# EAGLE design OneWireGateway_4x (EAGLE 7.2.0)

## Sheet 1 of 3
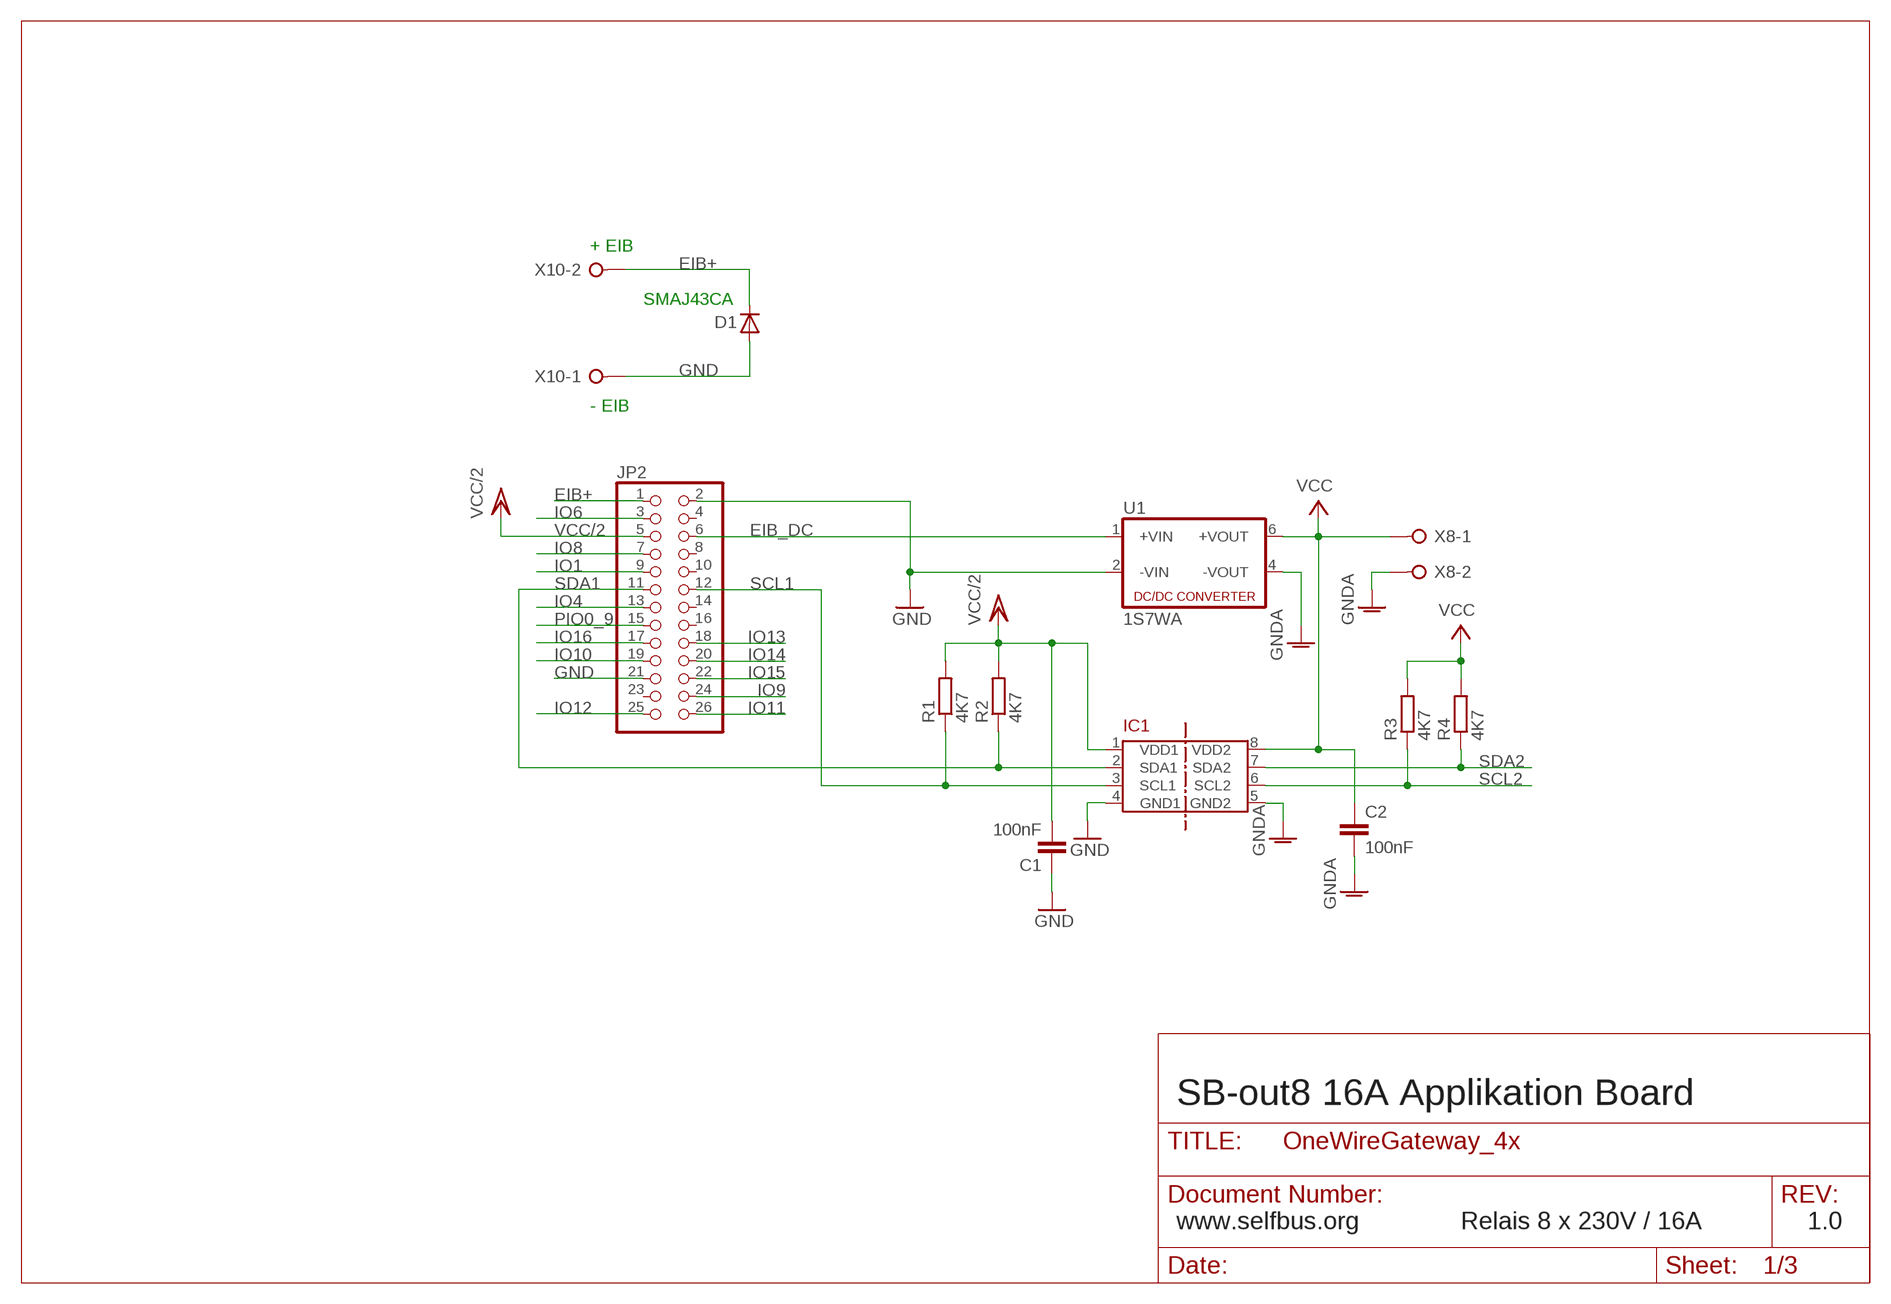
[diagram p0: schematic, sheet 1]

### Parts
C1  100nF  C-EUC0805  [C0805]
C2  100nF  C-EUC0805  [C0805]
D1  SMAJ40CA  D-SMB  [SMB]
IC1  ADUM1250  [SO08]
JP2  PINHD-2X13_2.54-SMD  [2X13SMD]
R1  4K7  R-EU_R0805  [R0805]
R2  4K7  R-EU_R0805  [R0805]
R3  4K7  R-EU_R0805  [R0805]
R4  4K7  R-EU_R0805  [R0805]
U1  1S7WA  [7PIN_SIP]
X8  W237-02P  [W237-132]
X10  W237-02P  [W237-132]

### Nets
EIB+: D1.1(C) JP2.1 X10.2
EIB_DC: JP2.6 U1.1(+VIN)
GND: C1.1 D1.2(A) IC1.4(GND1) JP2.2 JP2.21 U1.2(-VIN) X10.1
GNDA: C2.2 IC1.5(GND2) U1.4(-VOUT) X8.2 ; also sheet 2,3
IO1: JP2.9
IO4: JP2.13
IO6: JP2.3
IO8: JP2.7
IO9: JP2.24
IO10: JP2.19
IO11: JP2.26
IO12: JP2.25
IO13: JP2.18
IO14: JP2.20
IO15: JP2.22
IO16: JP2.17
PIO0_9: JP2.15
SCL1: IC1.3(SCL1) JP2.12 R1.1
SCL2: IC1.6(SCL2) R3.1 ; also sheet 2,3
SDA1: IC1.2(SDA1) JP2.11 R2.1
SDA2: IC1.7(SDA2) R4.1 ; also sheet 2,3
VCC: C2.1 IC1.8(VDD2) R3.2 R4.2 U1.6(+VOUT) X8.1 ; also sheet 2,3
VCC/2: C1.2 IC1.1(VDD1) JP2.5 R1.2 R2.2
Unconnected: JP2.4 JP2.8 JP2.10 JP2.14 JP2.16 JP2.23

### Notes on the sheet
- + EIB
- SMAJ43CA
- - EIB
- SB-out8 16A Applikation Board
- www.selfbus.org | Relais 8 x 230V / 16A | 1.0

## Sheet 2 of 3
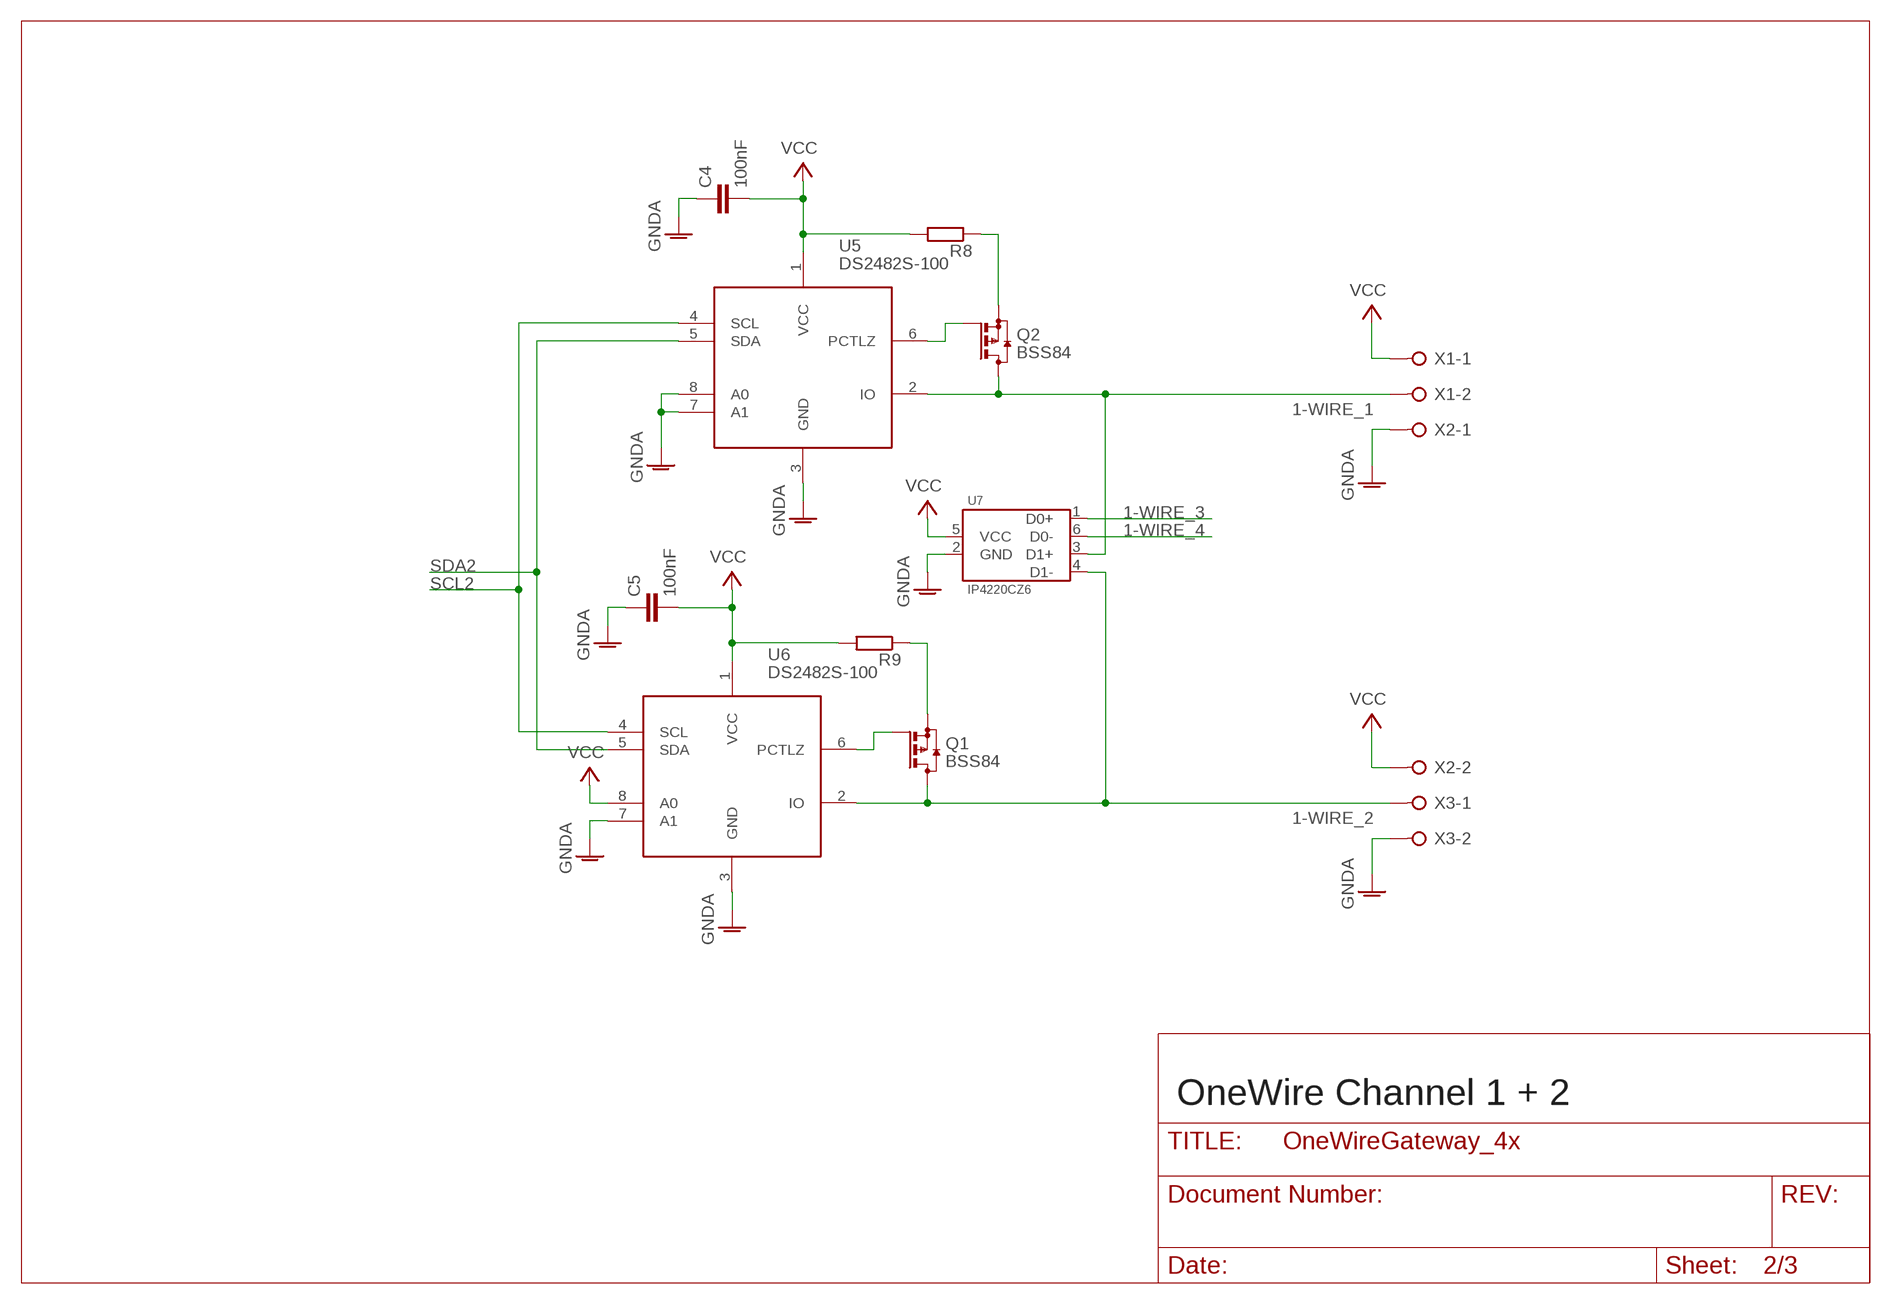
[diagram p1: schematic, sheet 2]

### Parts
C4  100nF  C-EUC0805  [C0805]
C5  100nF  C-EUC0805  [C0805]
Q1  BSS84  [SOT23]
Q2  BSS84  [SOT23]
R8  R-EU_R0805  [R0805]
R9  R-EU_R0805  [R0805]
U5  DS2482S-100  DS2482-100+1  [SO8]
U6  DS2482S-100  DS2482-100+1  [SO8]
U7  IP4220CZ6  [SOT-6]
X1  W237-02P  [W237-132]
X2  W237-02P  [W237-132]
X3  W237-02P  [W237-132]

### Nets
1-WIRE_1: Q2.3(D) U5.2(IO) U7.3(D1+) X1.2
1-WIRE_2: Q1.3(D) U6.2(IO) U7.4(D1-) X3.1
1-WIRE_3: U7.1(D0+) ; also sheet 3
1-WIRE_4: U7.6(D0-) ; also sheet 3
GNDA: C4.1 C5.1 U5.3(GND) U5.7(A1) U5.8(A0) U6.3(GND) U6.7(A1) U7.2(GND) X2.1 X3.2 ; also sheet 1,3
N$5: Q2.1(G) U5.6(PCTLZ)
N$8: Q2.2(S) R8.1
N$9: Q1.2(S) R9.1
N$13: Q1.1(G) U6.6(PCTLZ)
SCL2: U5.4(SCL) U6.4(SCL) ; also sheet 1,3
SDA2: U5.5(SDA) U6.5(SDA) ; also sheet 1,3
VCC: C4.2 C5.2 R8.2 R9.2 U5.1(VCC) U6.1(VCC) U6.8(A0) U7.5(VCC) X1.1 X2.2 ; also sheet 1,3

### Notes on the sheet
- OneWire Channel 1 + 2

## Sheet 3 of 3
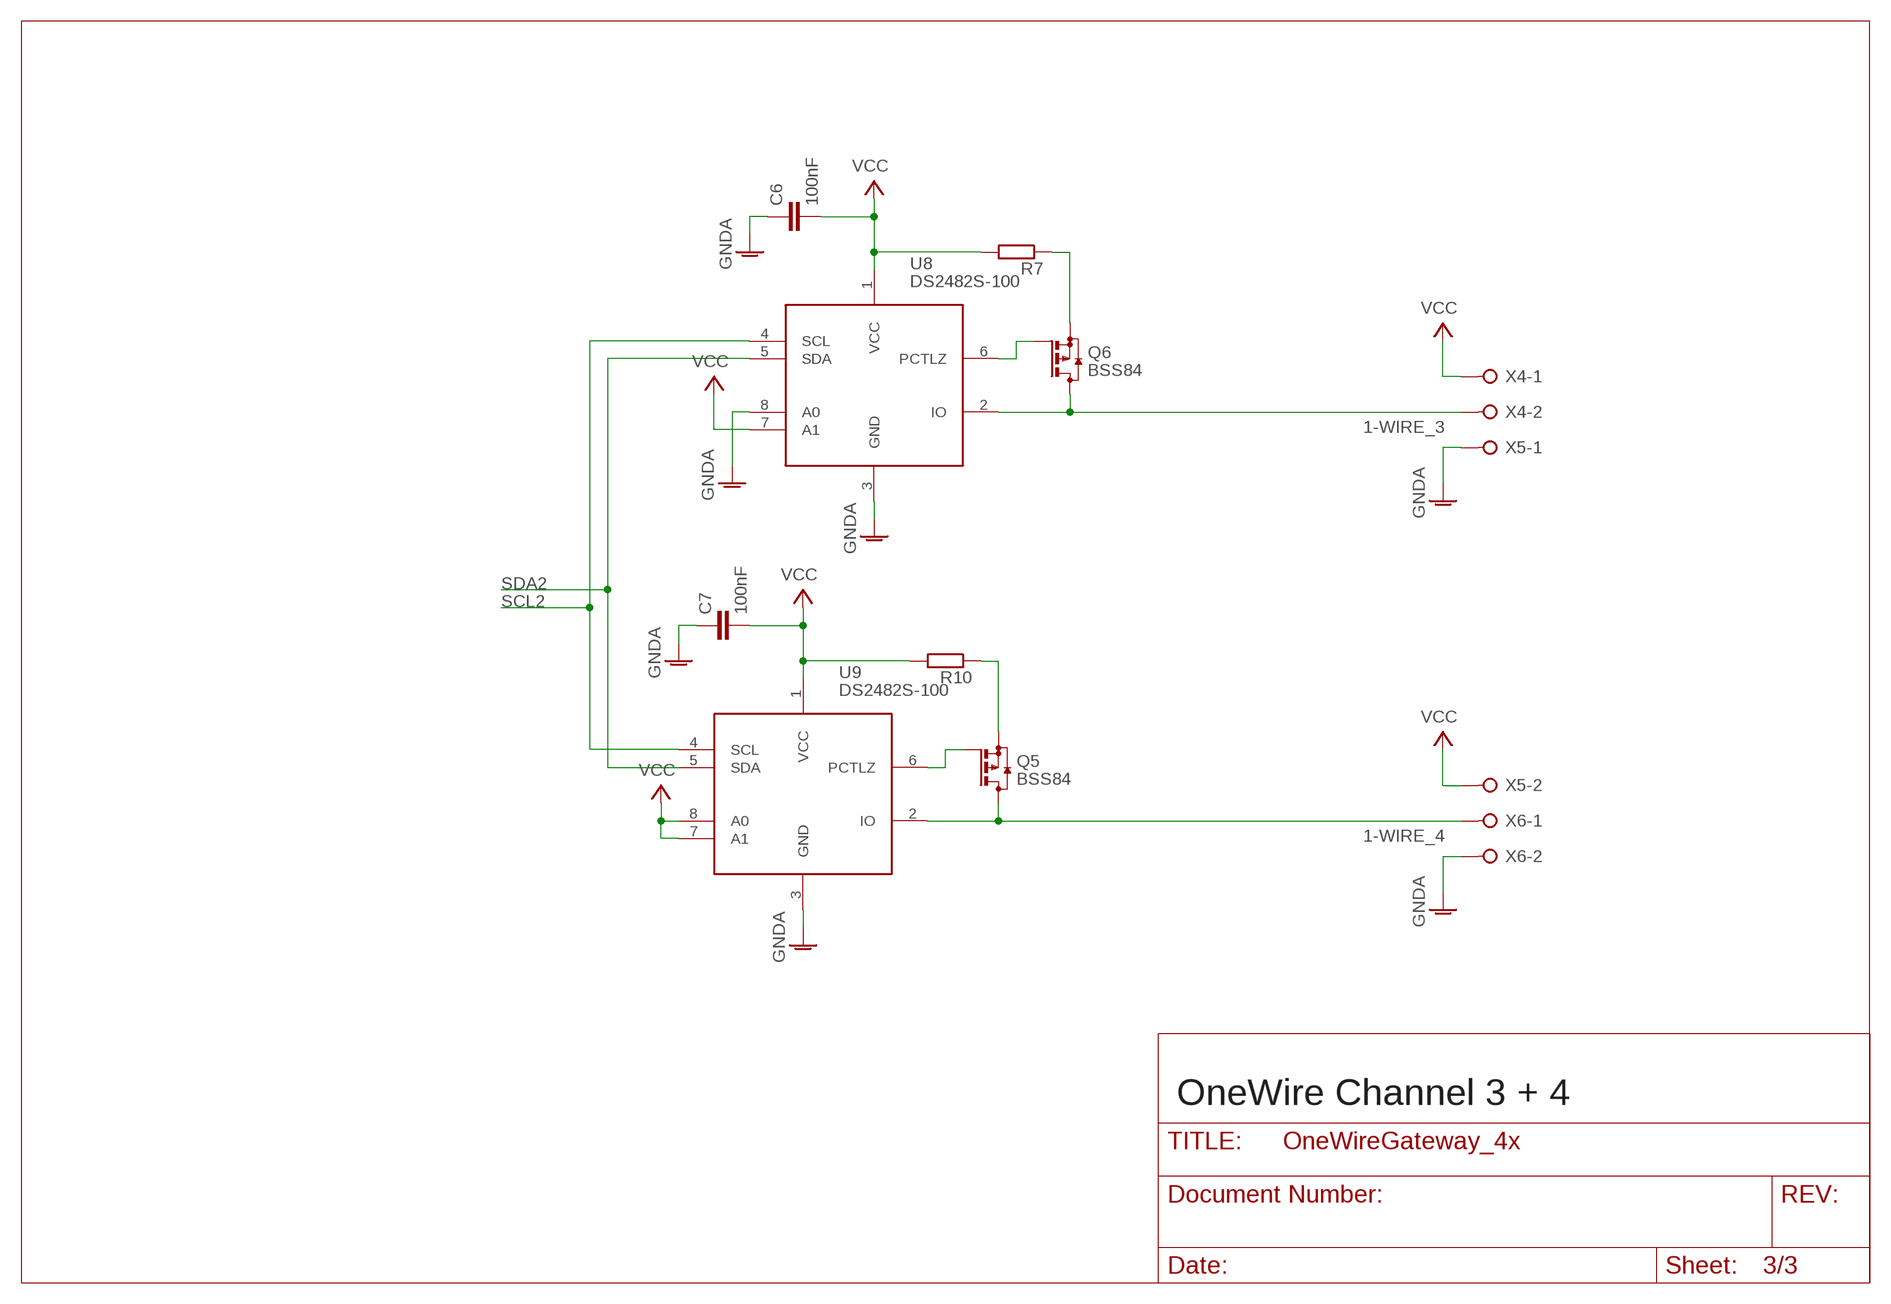
[diagram p2: schematic, sheet 3]

### Parts
C6  100nF  C-EUC0805  [C0805]
C7  100nF  C-EUC0805  [C0805]
Q5  BSS84  [SOT23]
Q6  BSS84  [SOT23]
R7  R-EU_R0805  [R0805]
R10  R-EU_R0805  [R0805]
U8  DS2482S-100  DS2482-100+1  [SO8]
U9  DS2482S-100  DS2482-100+1  [SO8]
X4  W237-02P  [W237-132]
X5  W237-02P  [W237-132]
X6  W237-02P  [W237-132]

### Nets
1-WIRE_3: Q6.3(D) U8.2(IO) X4.2 ; also sheet 2
1-WIRE_4: Q5.3(D) U9.2(IO) X6.1 ; also sheet 2
GNDA: C6.1 C7.1 U8.3(GND) U8.8(A0) U9.3(GND) X5.1 X6.2 ; also sheet 1,2
N$14: Q6.1(G) U8.6(PCTLZ)
N$15: Q6.2(S) R7.1
N$33: Q5.2(S) R10.1
N$34: Q5.1(G) U9.6(PCTLZ)
SCL2: U8.4(SCL) U9.4(SCL) ; also sheet 1,2
SDA2: U8.5(SDA) U9.5(SDA) ; also sheet 1,2
VCC: C6.2 C7.2 R7.2 R10.2 U8.1(VCC) U8.7(A1) U9.1(VCC) U9.7(A1) U9.8(A0) X4.1 X5.2 ; also sheet 1,2

### Notes on the sheet
- OneWire Channel 3 + 4

## Library data of the parts
C1 C2 C4-C7 = rcl:C-EU: CAPACITOR, European symbol
D1 = semicon-smd-ipc:D-: DIODE unfilled
IC1 = Bus-isolators:ADUM1250
JP2 = pinhead:PINHD-2X13: PIN HEADER
Q1 Q2 Q5 Q6 = transistor-small-signal:BSS84: P-CHANNEL MOS FET
R1-R4 R7-R10 = rcl:R-EU_: RESISTOR, European symbol
U1 = dcdc_Gaptec:1S7WA
U5 U6 U8 U9 = ak:DS2482-100+: 1-Wire to I2C Bridge; MF: Maxim Integrated; MPN: DS2482-100+; OC_DIGIKEY: DS2482S-100+T&RCT-ND; OC_FARNELL: 1593289; OC_MOUSER: 700-DS2482S-100
U7 = NXP:IP4220CZ6
X1-X6 X8 X10 = con-wago-508:W237-02P: WAGO SREW CLAMP; OC_FARNELL: unknown; OC_NEWARK: unknown

## Net classes
1 230Vac: width 1.93 mm, clearance 5.08 mm to class 0, clearance 1.905 mm

## Board
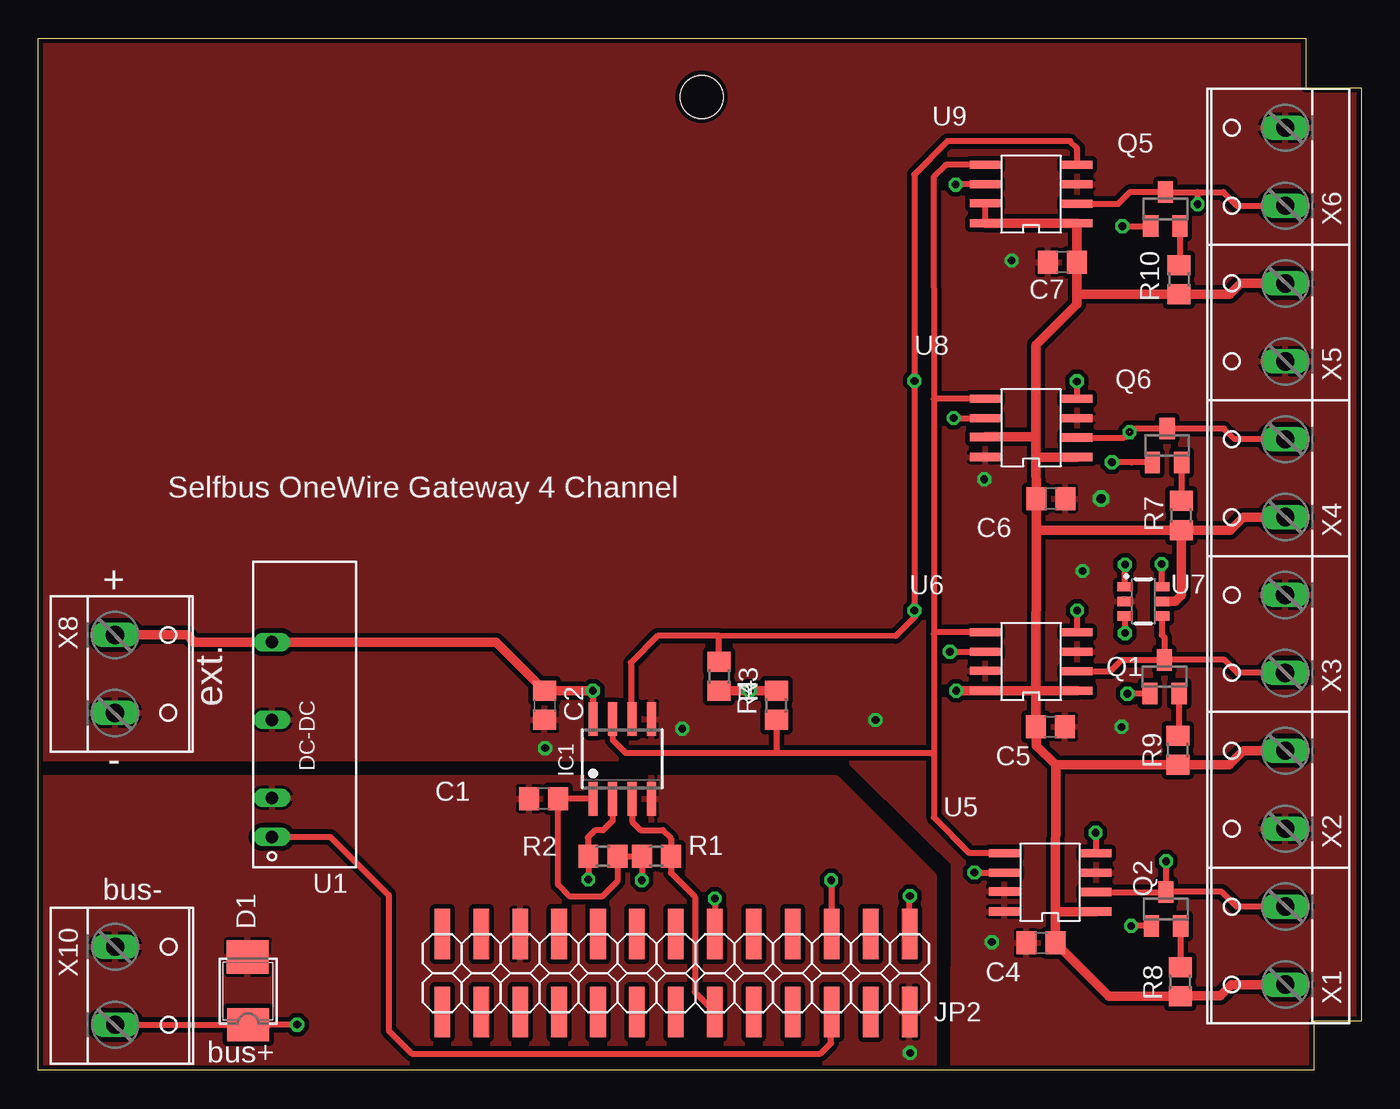
[diagram p3: board, top side]
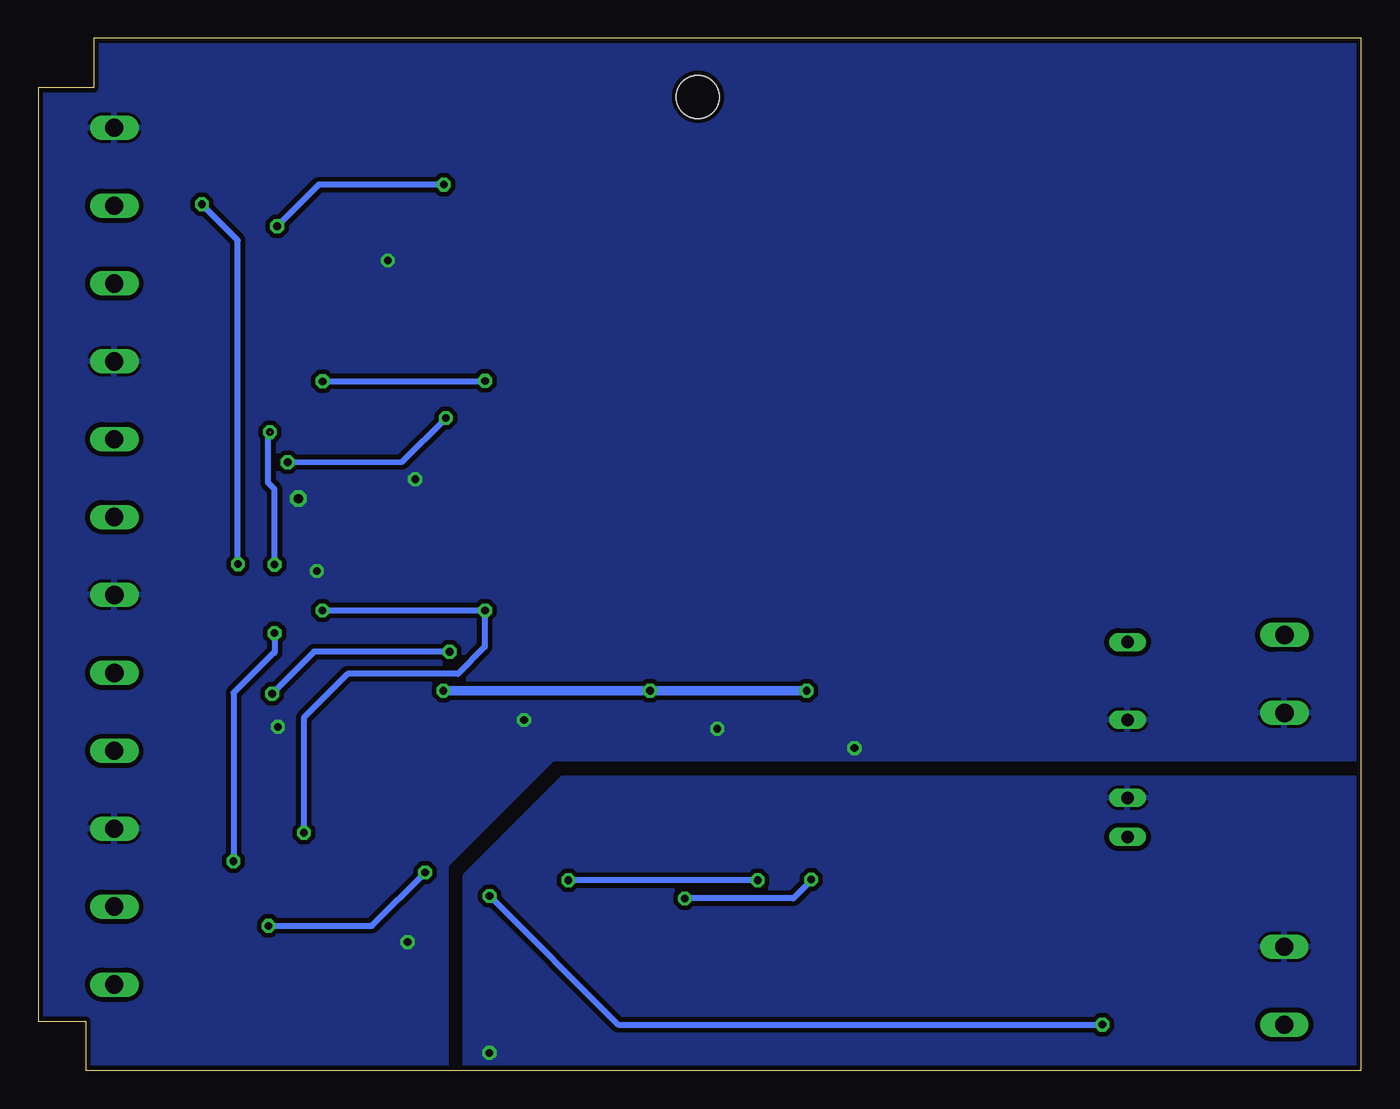
[diagram p4: board, bottom side, seen from below]

Size 86.3 x 67.31 mm. Coordinates in mm from the lower left corner, seen from the top.
Outline: 0,0 0,67.31 82.7,67.31 82.7,64.1 86.3,64.1 86.3,3.2 83.2,3.2 83.2,0 0,0
Copper layers (1*16): Top 0.035mm / dielectric 1.5mm / Bottom 0.035mm
Design rules "PCB-POOL Standard *": minimum track width 0.15mm, minimum drill 0.3mm, track to track 0.15mm, track to pad 0.15mm, pad to pad 0.15mm, via to via 0.15mm, smd to smd 0.15mm, copper to edge 0.3mm, drill to drill 0.2mm, minimum pad ring 0.2mm, minimum via ring 0.15mm, stop-mask expansion 4mil, vias tented up to drill 0.7mm, thermal gap 0.2mm
Holes 2.8 mm at 43.27,63.49

### Footprints (pad centres in the part's own frame; a part is rotated, then mirrored left to right if it is on the bottom)
C0805 = smd 1.3 x 1.5: 1 -0.95,0; 2 0.95,0
SMB = smd 2.159 x 2.743: 1 -2.311,-0.127; 2 2.108,-0.102
SO08 = smd 0.6 x 2.2: 1 -1.905,-2.6; 2 -0.635,-2.6; 3 0.635,-2.6; 4 1.905,-2.6; 5 1.905,2.6; 6 0.635,2.6; 7 -0.635,2.6; 8 -1.905,2.6
2X13SMD = smd 1.016 x 3.302: 1 -1.27,-3.81; 2 -1.27,1.27; 3 1.27,-3.81; 4 1.27,1.27; 5 3.81,-3.81; 6 3.81,1.27; 7 6.35,-3.81; 8 6.35,1.27; 9 8.89,-3.81; 10 8.89,1.27; 11 11.43,-3.81; 12 11.43,1.27; 13 13.97,-3.81; 14 13.97,1.27; 15 16.51,-3.81; 16 16.51,1.27; 17 19.05,-3.81; 18 19.05,1.27; 19 21.59,-3.81; 20 21.59,1.27; 21 24.13,-3.81; 22 24.13,1.27; 23 26.67,-3.81; 24 26.67,1.27; 25 29.21,-3.81; 26 29.21,1.27
SOT23 = smd 1 x 1.4: 1 -0.95,-1.1; 2 0.95,-1.1; 3 0,1.1
R0805 = smd 1.3 x 1.5: 1 -0.95,0; 2 0.95,0
7PIN_SIP = drill 0.813 long: 1 1.27,5.08; 2 1.27,2.54; 4 1.27,-2.54; 6 1.27,-7.62
SO8 = smd 2 x 0.53: 1 -3,1.905; 2 -3,0.635; 3 -3,-0.635; 4 -3,-1.905; 5 3,-1.905; 6 3,-0.635; 7 3,0.595; 8 3,1.905
SOT-6 = smd 1 x 0.6: 1 -1.2,0.95; 2 -1.2,0; 3 -1.2,-0.95; 4 1.2,-0.95; 5 1.2,0; 6 1.2,0.95
W237-132 = drill 1.194 long: 1 -2.54,-0.635; 2 2.54,-0.635

### Placement (x,y rotation side)
C1  32.96,17.73 0 top
C2  33.04,23.81 270 top
C4  65.41,8.32 0 top
C5  66.03,22.41 180 top
C6  66.05,37.3 180 top
C7  66.81,52.72 0 top
D1  13.56,5.29 90 top
IC1  38.1,20.32 0 top
JP2  55.56,5.08 180 top
Q1  73.46,25.67 0 top
Q2  73.56,10.53 0 top
Q5  73.52,56.18 0 top
Q6  73.63,40.76 0 top
R1  40.32,13.97 180 top
R2  36.83,13.97 0 top
R3  44.42,25.7 270 top
R4  48.15,23.81 90 top
R7  74.56,36.19 270 top
R8  74.5,5.78 270 top
R9  74.33,20.89 270 top
R10  74.42,51.57 270 top
U1  16.51,20.32 180 top
U5  66.01,12.27 180 top
U6  64.77,26.67 180 top
U7  72.09,30.59 0 top
U8  64.77,41.91 180 top
U9  64.77,57.15 180 top
X1  80.71,8.14 90 top
X2  80.71,18.3 90 top
X3  80.7,28.47 90 top
X4  80.71,38.63 90 top
X5  80.71,48.78 90 top
X6  80.71,58.93 90 top
X8  5.64,25.86 270 top
X10  5.65,5.52 270 top

### Tracks (layer width: path | path; a pad name or v marks a point on that pad's centre or on a via)
1-WIRE_1  (via drill 0.5)
  Top 0.406: X1.2 78.17,10.68 77.22,11.64 Q2.3 | U5.2 Q2.3 | U7.3 v70.89,28.52 | v73.57,13.64 Q2.3
  Bottom 0.406: v70.89,28.52 70.89,27.24 70.96,27.24 73.57,24.63 v73.57,13.64
1-WIRE_2
  Top 0.406: X3.1 78.2,25.93 77.36,26.77 Q1.3 | 73.52,26.83 Q1.3 | U7.4 73.29,28.4 73.46,28.23 Q1.3 | U6.2 69.94,26.04 70.68,26.77 Q1.3
1-WIRE_3  (via drill 0.5)  (1 unrouted)
  Top 0.406: X4.2 78.04,41.17 77.35,41.86 Q6.3 71.43,41.87 v71.19,41.63 70.83,41.27 U8.2 | U7.1 v70.89,32.99
  Bottom 0.406: v70.89,32.99 70.89,37.9 71.32,38.33 71.32,41.53 71.2,41.65
1-WIRE_4  (via drill 0.5)
  Top 0.406: 75.63,57.28 Q5.3 71.23,57.29 70.45,56.52 U9.2 | 75.63,57.28 77.31,57.28 78.2,56.39 X6.1 | U7.6 v73.29,33.01 v73.28,33.02 | v75.63,56.49 75.63,57.28
  Bottom 0.406: v73.28,33.02 73.28,54.14 v75.63,56.49
EIB+  (via drill 0.5)
  Top 0.406: X10.2 D1.1 v16.88,2.99 | JP2.1 56.83,11.35 v56.86,11.38
  Bottom 0.406: v56.86,11.38 48.47,2.99 v16.88,2.99
EIB_DC
  Top 0.406: U1.1 19.05,15.24 22.86,11.43 22.86,2.6 24.36,1.1 51.03,1.1 51.72,1.79 51.72,3.78 JP2.6
GND  (via drill 0.5)
  other vias: 56.87,1.15
  pour Top (isolate 0.305): 0,0 58.42,0 58.42,12.7 52.07,19.05 0,19.05
  pour Bottom (isolate 0.305): 0,0 58.42,0 58.42,12.7 52.07,19.05 0,19.05
GNDA  (via drill 0.5, 0.6)
  other vias: 54.61,22.86 69.33,37.29 63.5,52.82 70.67,22.41 62.21,8.37 42.01,22.28 33.06,21.02 68.13,32.57 61.71,38.56
  pour Top (isolate 0.305): 0,67.31 86.36,67.31 86.36,0 59.69,0 59.72,13.53 52.79,20.32 0,20.32
  pour Bottom (isolate 0.305): 0,67.31 86.36,67.31 86.36,0 59.69,0 59.69,13.43 52.75,20.37 0.05,20.37 0,20.32
N$5  (via drill 0.5)
  Top 0.406: Q2.1 v71.29,9.43 | v61.07,12.91 U5.6
  Bottom 0.406: v71.29,9.43 64.55,9.43 v61.07,12.91
N$8
  Top 0.406: Q2.2 R8.1
N$9
  Top 0.406: Q1.2 74.41,21.92 R9.1
N$13  (via drill 0.5)
  Top 0.406: Q1.1 v71.05,24.57 | v59.47,27.31 U6.6
  Bottom 0.406: v59.47,27.31 68.31,27.31 v71.05,24.57
N$14  (via drill 0.5)
  Top 0.406: v59.71,42.55 U8.6 | Q6.1 71.32,39.66 v70.04,39.67
  Bottom 0.406: v70.04,39.67 62.57,39.69 v59.71,42.55
N$15
  Top 0.406: Q6.2 74.58,37.16 R7.1
N$33
  Top 0.406: Q5.2 74.47,52.57 R10.1
N$34  (via drill 0.5)
  Top 0.406: U9.6 59.85,57.78 v59.84,57.77 | v70.72,55.05 72.54,55.05 Q5.1
  Bottom 0.406: v59.84,57.77 68,57.77 v70.72,55.05
SCL1
  Top 0.406: IC1.3 38.73,16.23 39.29,15.67 40.73,15.67 41.27,15.13 R1.1 41.27,12.88 42.83,11.32 42.83,5.11 JP2.12
SCL2  (via drill 0.5)
  Top 0.406: U9.4 67.77,60.14 67.31,60.6 59.32,60.6 57.15,58.42 v57.15,44.97 v57.15,30 57.2,29.6 55.93,28.33 44.45,28.34 | 44.45,28.34 40.41,28.34 38.66,26.59 38.68,22.98 IC1.6 | U6.4 v67.77,30 | U8.4 67.77,44.92 v67.75,44.94 | U5.4 69.01,15.47 v68.98,15.5 | R3.1 44.42,28.31 44.45,28.34
  Bottom 0.406: v67.77,30 v57.15,30 57.18,29.97 57.18,27.62 58.93,25.87 66.11,25.87 68.98,23 v68.98,15.5 | v67.75,44.94 57.18,44.94 v57.15,44.97
SDA1  (via drill 0.5)
  Top 0.406: IC1.2 37.47,16.3 36.83,15.66 36.32,15.66 35.86,15.2 35.86,13.99 R2.1 v35.88,12.46 | v44.13,11.21 JP2.11
  Bottom 0.406: v35.88,12.46 35.88,12.38 37.04,11.22 v44.12,11.22 v44.13,11.21
SDA2
  Top 0.406: U9.5 59.2,59.05 58.41,58.27 58.42,43.78 | 58.42,43.78 58.42,28.47 | 58.42,28.47 58.42,20.54 | 58.42,20.54 58.42,16.51 60.76,14.18 U5.5 | U6.5 58.52,28.57 58.42,28.47 | U8.5 58.45,43.81 58.42,43.78 | IC1.7 37.47,21.57 38.32,20.71 48.26,20.71 | 48.26,20.71 58.25,20.71 58.42,20.54 | R4.1 48.15,20.82 48.26,20.71
VCC  (via drill 0.5)
  Top 0.406: 81.33,51.34 X5.2 | U9.1 | 74.54,4.87 R8.2 | R9.2 | 65.03,41.31 65.09,41.38 | 67.94,50.62 67.76,50.8 | 65.09,40.01 | 65.09,24.79 65.06,24.77 65.28,24.77 65.08,24.57 | 65.1,22.39 C5.2 | 66.53,10.37 66.35,10.54 | C4.2 | v59.88,24.77 v59.88,24.76 | v36.18,24.76 36.18,24.13 IC1.8 | 48.12,24.76 R4.2 | 44.44,24.77 R3.2 | 65.2,35.24 65.1,35.14 | U9.8 U9.7
  Top 0.61: 81.33,51.34 78.45,51.34 77.73,50.62 R10.2 67.94,50.62 | U9.8 U9.1 | U9.1 C7.2 67.76,50.8 67.76,49.98 65.09,47.31 65.09,41.38 65.09,40.01 C6.2 65.1,35.14 65.09,24.79 | X1.1 77.83,5.6 77.1,4.87 74.54,4.87 | X2.2 78.61,20.84 77.69,19.93 R9.2 | U8.7 65.03,41.31 | U8.1 65.09,40.01 | 65.06,24.77 U6.8 v59.88,24.77 | U6.1 65.28,24.77 | C5.2 65.08,24.57 | R7.2 74.56,30.98 74.17,30.59 U7.5 | 66.37,19.94 66.35,10.54 C4.2 | 66.37,19.94 65.12,21.19 65.1,22.39 | U5.1 66.53,10.37 | R8.2 69.85,4.83 C4.2 | R9.2 66.37,19.94 | v36.18,24.76 C2.1 29.86,27.94 U1.6 10.16,27.94 9.7,28.4 X8.1 | v46.39,24.77 R4.2 | v46.38,24.76 R3.2 | R7.2 65.2,35.24 | X4.1 78.61,36.09 77.77,35.24 R7.2
  Bottom 0.406: v46.38,24.76 v46.39,24.77
  Bottom 0.61: v59.88,24.76 v46.38,24.76 v36.18,24.76
VCC/2  (via drill 0.5)
  Top 0.406: IC1.1 C1.2 33.91,12.1 34.67,11.34 36.78,11.34 37.78,12.34 R2.2 R1.2 v39.37,12.41 | v51.73,12.41 51.73,8.91 JP2.5
  Bottom 0.406: v39.37,12.41 v51.73,12.41

### Text on the board
tPlace: Selfbus OneWire Gateway 4 Channel | + | ext. | -
tNames: bus- | bus+